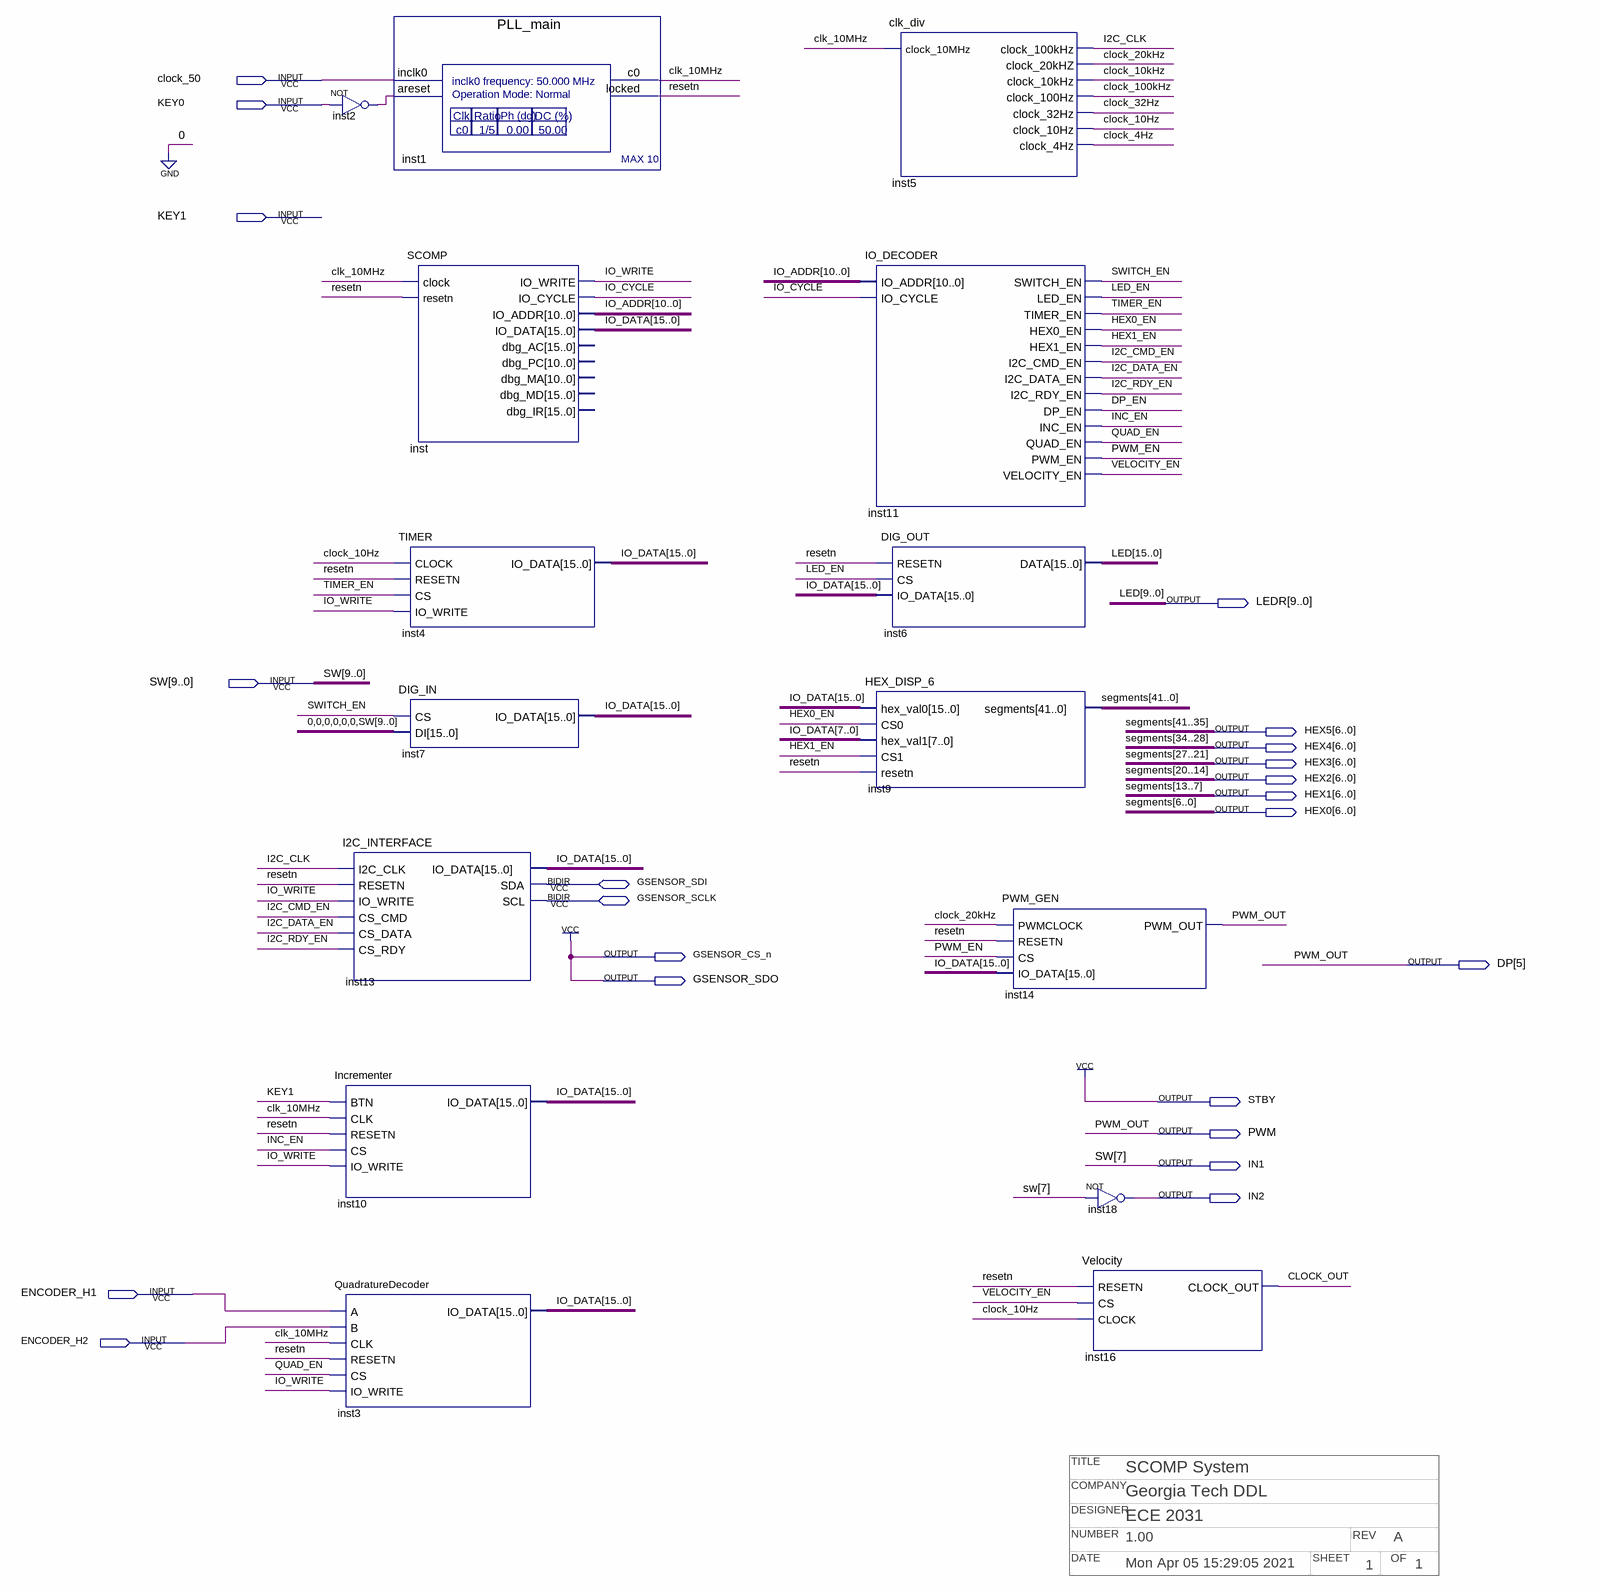
[diagram p0: schematic sheet]
// Quartus schematic SCOMP_System.bdf as structural Verilog: 15 symbols, 22 pins
// Title block: COMPANY: Georgia Tech DDL; DATE: Mon Apr 05 15:29:05 2021; DESIGNER: ECE 2031; NUMBER: 1.00; OF: 1; REV: A; SHEET: 1; TITLE: SCOMP System
module SCOMP_System (
  input  clock_50,
  input  KEY0,
  input  KEY1,
  input  [9:0] SW,
  input  ENCODER_H1,
  input  ENCODER_H2,
  inout  GSENSOR_SDI,
  inout  GSENSOR_SCLK,
  output [9:0] LEDR,
  output [6:0] HEX5,
  output [6:0] HEX4,
  output [6:0] HEX3,
  output [6:0] HEX2,
  output [6:0] HEX1,
  output [6:0] HEX0,
  output GSENSOR_CS_n,
  output [5:5] DP,
  output GSENSOR_SDO,
  output STBY,
  output PWM,
  output IN1,
  output IN2
);

  wire clk_10MHz, clock_4Hz, clock_10Hz, clock_10kHz, clock_20kHz, clock_32Hz, clock_100kHz, CLOCK_OUT,
       DP_EN, HEX0_EN, HEX1_EN, I2C_CLK, I2C_CMD_EN, I2C_DATA_EN, I2C_RDY_EN, INC_EN, inst2_out, IO_CYCLE,
       IO_WRITE, LED_EN, PWM_EN, QUAD_EN, resetn, SWITCH_EN, TIMER_EN, VELOCITY_EN;
  wire [10:0] IO_ADDR;
  wire [15:0] IO_DATA;
  wire [15:10] LED;

  not inst2 (inst2_out, KEY0);
  Incrementer inst10 (
    .BTN(KEY1), .CLK(clk_10MHz), .RESETN(resetn), .CS(INC_EN), .IO_WRITE(IO_WRITE), .IO_DATA(IO_DATA));
  QuadratureDecoder inst3 (
    .A(ENCODER_H1), .B(ENCODER_H2), .CLK(clk_10MHz), .RESETN(resetn), .CS(QUAD_EN), .IO_WRITE(IO_WRITE),
    .IO_DATA(IO_DATA));
  PLL_main inst1 (.inclk0(clock_50), .areset(inst2_out), .c0(clk_10MHz), .locked(resetn));
  TIMER inst4 (.CLOCK(clock_10Hz), .RESETN(resetn), .CS(TIMER_EN), .IO_WRITE(IO_WRITE), .IO_DATA(IO_DATA));
  DIG_IN inst7 (.CS(SWITCH_EN), .DI({{6{1'b0}}, SW}), .IO_DATA(IO_DATA));
  I2C_INTERFACE inst13 (
    .I2C_CLK(I2C_CLK), .RESETN(resetn), .IO_WRITE(IO_WRITE), .CS_CMD(I2C_CMD_EN), .CS_DATA(I2C_DATA_EN),
    .CS_RDY(I2C_RDY_EN), .IO_DATA(IO_DATA), .SDA(GSENSOR_SDI), .SCL(GSENSOR_SCLK));
  SCOMP inst (
    .clock(clk_10MHz), .resetn(resetn), .IO_WRITE(IO_WRITE), .IO_CYCLE(IO_CYCLE), .IO_ADDR(IO_ADDR),
    .IO_DATA(IO_DATA));  // open: dbg_AC, dbg_PC, dbg_MA, dbg_MD, dbg_IR
  clk_div inst5 (
    .clock_10MHz(clk_10MHz), .clock_100kHz(I2C_CLK), .clock_20kHZ(clock_20kHz), .clock_10kHz(clock_10kHz),
    .clock_100Hz(clock_100kHz), .clock_32Hz(clock_32Hz), .clock_10Hz(clock_10Hz), .clock_4Hz(clock_4Hz));
  IO_DECODER inst11 (
    .IO_ADDR(IO_ADDR), .IO_CYCLE(IO_CYCLE), .SWITCH_EN(SWITCH_EN), .LED_EN(LED_EN), .TIMER_EN(TIMER_EN),
    .HEX0_EN(HEX0_EN), .HEX1_EN(HEX1_EN), .I2C_CMD_EN(I2C_CMD_EN), .I2C_DATA_EN(I2C_DATA_EN),
    .I2C_RDY_EN(I2C_RDY_EN), .DP_EN(DP_EN), .INC_EN(INC_EN), .QUAD_EN(QUAD_EN), .PWM_EN(PWM_EN),
    .VELOCITY_EN(VELOCITY_EN));
  DIG_OUT inst6 (.RESETN(resetn), .CS(LED_EN), .IO_DATA(IO_DATA), .DATA({LED, LEDR}));
  HEX_DISP_6 inst9 (
    .hex_val0(IO_DATA), .CS0(HEX0_EN), .hex_val1(IO_DATA[7:0]), .CS1(HEX1_EN), .resetn(resetn),
    .segments({HEX5, HEX4, HEX3, HEX2, HEX1, HEX0}));
  PWM_GEN inst14 (.PWMCLOCK(clock_20kHz), .RESETN(resetn), .CS(PWM_EN), .IO_DATA(IO_DATA), .PWM_OUT(DP[5]));
  not inst18 (IN2, SW[7]);
  Velocity inst16 (.RESETN(resetn), .CS(VELOCITY_EN), .CLOCK(clock_10Hz), .CLOCK_OUT(CLOCK_OUT));

  assign GSENSOR_CS_n = 1'b1;
  assign GSENSOR_SDO = 1'b1;
  assign IN1 = SW[7];
  assign PWM = DP[5];
  assign STBY = 1'b1;

  // Other names for the same wires on the sheet: LED[9:0] = LEDR; PWM_OUT = DP[5];
  //   segments[41:0] = {HEX5, HEX4, HEX3, HEX2, HEX1, HEX0}
endmodule
